# Altium project ORINIUM_UAV.PrjPcb (part 1 of 5)
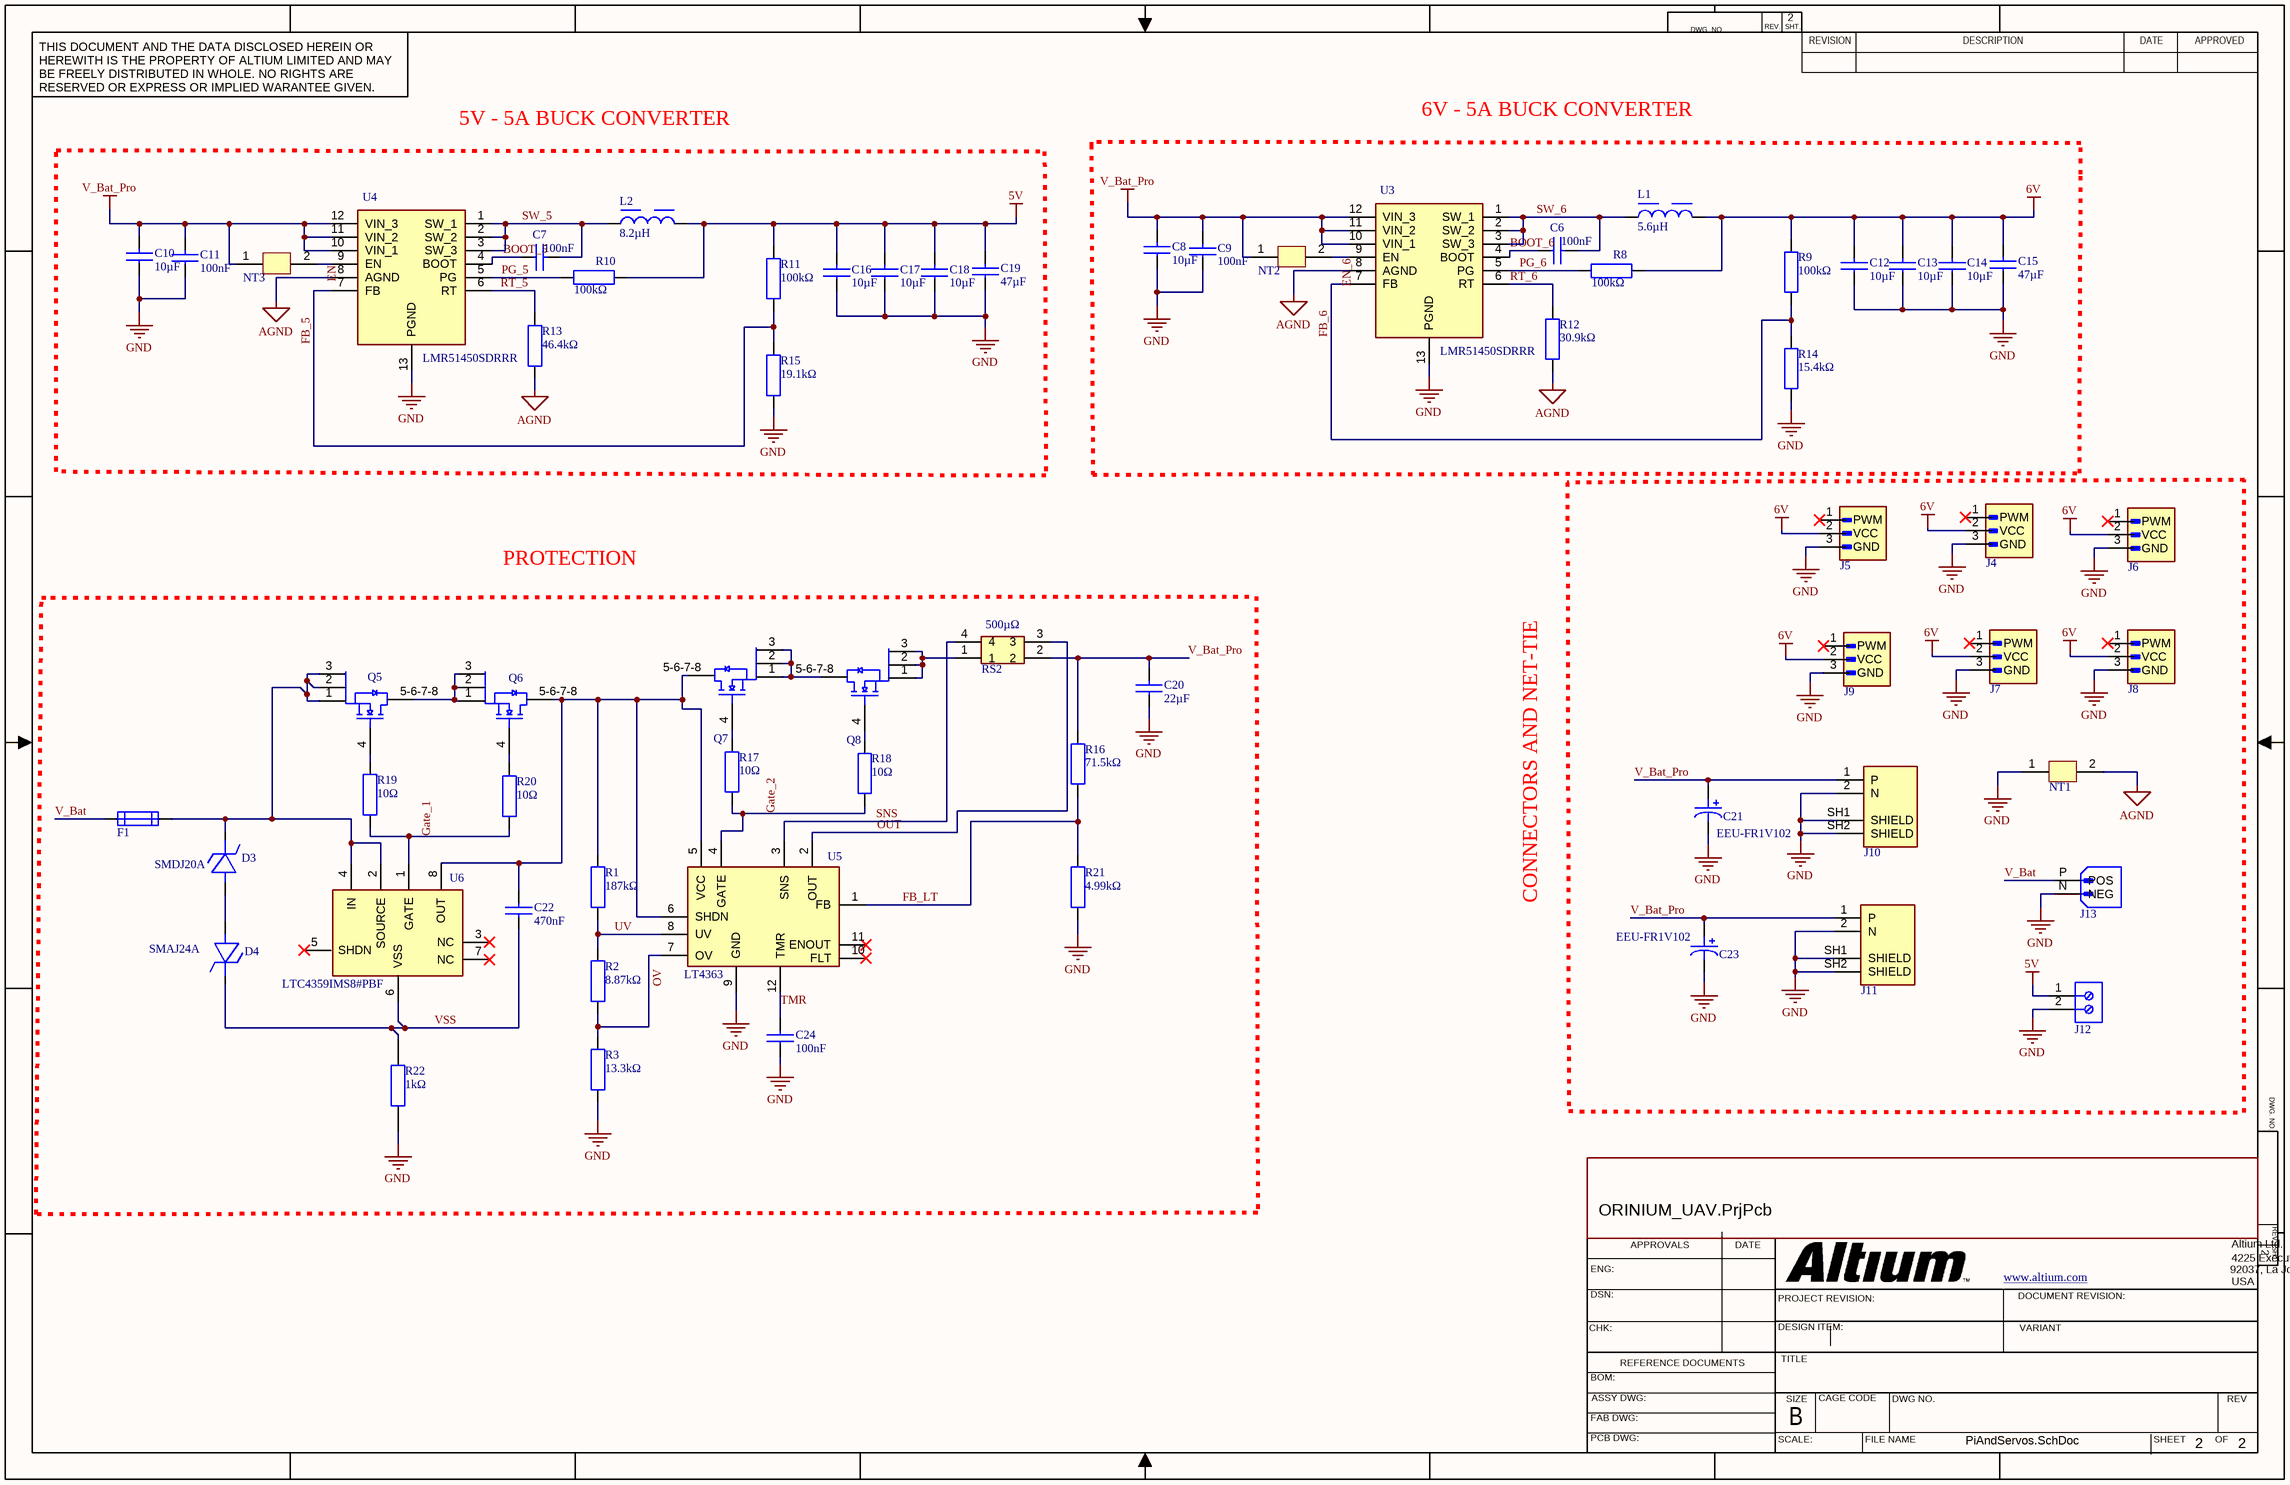
[diagram p0: PiAndServos.SchDoc]
1 sheet, 64 parts. Net scope: global (net labels, ports and power ports of the same name join across sheets).
Board file: UAV.PcbDoc

## Sheet PiAndServos.SchDoc
size 431 x 279 mm; Organization: ORGANIZATION; Address1: ADDRESS 1; Address2: ADDRESS 2; Address3: ADDRESS 3; Address4: ADDRESS 4; Revision: -; SheetNumber: 2; SheetTotal: 2; ENG_APP_DATE: --/--/--; DSN_APP_DATE: --/--/--; CHK_APP_DATE: --/--/--

### Parts
C6  value 100nF  [CAP 0402]  (hidden comment: GRM155R71C104KA88D)
C7  value 100nF  [CAP 0402]  (hidden comment: GRM155R71C104KA88D)
C8  value 10µF  [CAP 1210]  (hidden comment: C3225X7R1H106M250AC)
C9  value 100nF  [CAP 0603]  (hidden comment: CC0603KRX7R9BB104)
C10  value 10µF  [CAP 1210]  (hidden comment: C3225X7R1H106M250AC)
C11  value 100nF  [CAP 0603]  (hidden comment: CC0603KRX7R9BB104)
C12  value 10µF  [CAP 1210]  (hidden comment: C3225X7R1H106M250AC)
C13  value 10µF  [CAP 1210]  (hidden comment: C3225X7R1H106M250AC)
C14  value 10µF  [CAP 1210]  (hidden comment: C3225X7R1H106M250AC)
C15  value 47µF  [CAP 1210]  (hidden comment: GRM32ER61C476KE15L)
C16  value 10µF  [CAP 1210]  (hidden comment: C3225X7R1H106M250AC)
C17  value 10µF  [CAP 1210]  (hidden comment: C3225X7R1H106M250AC)
C18  value 10µF  [CAP 1210]  (hidden comment: C3225X7R1H106M250AC)
C19  value 47µF  [CAP 1210]  (hidden comment: GRM32ER61C476KE15L)
C20  value 22µF  [CAP 2220]  (hidden comment: C5750X7R1H226M250KB)
C21  EEU-FR1V102  [CAP ALUM THT]
C22  value 470nF  [CAP 0603]  (hidden comment: W3F15C4738AT1F)
C23  EEU-FR1V102  [CAP ALUM THT]
C24  value 100nF  [CAP 0402]  (hidden comment: GRM155R71C104KA88D)
D3  SMDJ20A  [SMC (DO-214AB)]
D4  SMAJ24A  [SMA (DO-214AC)]
F1  SF-3812F6000T-2  [SF-3812F6000T-2]  (value not drawn)
J4  61300311121  [1X3 MALE HEADER]  (value not drawn)
J5  61300311121  [1X3 MALE HEADER]  (value not drawn)
J6  61300311121  [1X3 MALE HEADER]  (value not drawn)
J7  61300311121  [1X3 MALE HEADER]  (value not drawn)
J8  61300311121  [1X3 MALE HEADER]  (value not drawn)
J9  61300311121  [1X3 MALE HEADER]  (value not drawn)
J10  XT60PW-M  [XT60PW-M]  (value not drawn)
J11  XT60PW-M  [XT60PW-M]  (value not drawn)
J12  1725656  [1725656]  (value not drawn)
J13  XT90-S  [XT90]  (value not drawn)
L1  value 5.6µH  [XAL6060-822MEB]  (hidden comment: XAL6060-562MEB)
L2  value 8.2µH  [XAL6060-822MEB]  (hidden comment: XAL6060-822MEB)
NT1  Net-Tie  [Net-Tie]  (value not drawn)  (net tie, no BOM)
NT2  Net-Tie  [Net-Tie]  (value not drawn)  (net tie, no BOM)
NT3  Net-Tie  [Net-Tie]  (value not drawn)  (net tie, no BOM)
Q5  BSC010N04LSI  [SON 5X6]  (value not drawn)
Q6  BSC010N04LSI  [SON 5X6]  (value not drawn)
Q7  BSC010N04LSI  [SON 5X6]  (value not drawn)
Q8  BSC010N04LSI  [SON 5X6]  (value not drawn)
R1  value 187kΩ  [RES 1206]  (hidden comment: RC0805FR-07187KL)
R2  value 8.87kΩ  [RES 1206]  (hidden comment: RC0805FR-078K87L)
R3  value 13.3kΩ  [RES 1206]  (hidden comment: RC0805FR-0713K3L)
R8  value 100kΩ  [RES 0603]  (hidden comment: CRCW0603100KFKEA)
R9  value 100kΩ  [RES 0402]  (hidden comment: CRCW0402100KFKED)
R10  value 100kΩ  [RES 0603]  (hidden comment: CRCW0603100KFKEA)
R11  value 100kΩ  [RES 0402]  (hidden comment: CRCW0402100KFKED)
R12  value 30.9kΩ  [RES 0402]  (hidden comment: CRCW040230K9FKED)
R13  value 46.4kΩ  [RES 0603]  (hidden comment: CRCW060346K4FKEA)
R14  value 15.4kΩ  [RES 0402]  (hidden comment: AC0402FR-0715K4L)
R15  value 19.1kΩ  [RES 0402]  (hidden comment: CRCW040219K1FKED)
R16  value 71.5kΩ  [RES 0603]  (hidden comment: RC0603FR-0771K5L)
R17  value 10Ω  [SR0805FR-7W10RL]  (hidden comment: SR0805FR-7W10RL)
R18  value 10Ω  [SR0805FR-7W10RL]  (hidden comment: SR0805FR-7W10RL)
R19  value 10Ω  [SR0805FR-7W10RL]  (hidden comment: SR0805FR-7W10RL)
R20  value 10Ω  [SR0805FR-7W10RL]  (hidden comment: SR0805FR-7W10RL)
R21  value 4.99kΩ  [RES 0402]  (hidden comment: ERJ-2RKF4991X)
R22  value 1kΩ  [RES 1206]  (hidden comment: SR1206FR-071KL)
RS2  value 500µΩ  [SR_4026]  (hidden comment: WSLP4026L5000FEA)
U3  LMR51450SDRRR  [WSON -12]
U4  LMR51450SDRRR  [WSON -12]
U5  LT4363  [MSOP-12]
U6  LTC4359IMS8#PBF  [MSOP-8]

### Blocks framed on the sheet
5V - 5A BUCK CONVERTER: C7 C10 C11 C16-C19 L2 NT3 R10 R11 R13 R15 U4

### Nets
5V: C16.2 C17.2 C18.2 C19.2 J12.1(VCC) L2.2 R10.2 R11.2
6V: C12.2 C13.2 C14.2 C15.2 J4.2(VCC) J5.2(VCC) J6.2(VCC) J7.2(VCC) J8.2(VCC) J9.2(VCC) L1.2 R8.2 R9.2
AGND: NT1.2 R12.1 R13.1 U3.8(AGND) U4.8(AGND)
GND: C8.1 C9.1 C10.1 C11.1 C12.1 C13.1 C14.1 C15.1 C16.1 C17.1 C18.1 C19.1 C20.1 C21.2 C23.2 C24.1 J4.3(GND) J5.3(GND) J6.3(GND) J7.3(GND) J8.3(GND) J9.3(GND) J10.2(N) J10.SH1(SHIELD) J10.SH2(SHIELD) J11.2(N) J11.SH1(SHIELD) J11.SH2(SHIELD) J12.2(GND) J13.N(NEG) NT1.1 R3.1 R14.1 R15.1 R21.1 R22.1 U3.13(PGND) U4.13(PGND) U5.9(GND)
V_Bat_Pro: C8.2 C9.2 C10.2 C11.2 C20.2 C21.1 C23.1 J10.1(P) J11.1(P) NT2.1 NT3.1 R16.2 RS2.2 U3.10(VIN_1) U3.11(VIN_2) U3.12(VIN_3) U4.10(VIN_1) U4.11(VIN_2) U4.12(VIN_3)
BOOT_5: C7.1 U4.4(BOOT)
BOOT_6: C6.1 U3.4(BOOT)
EN: NT3.2 U4.9(EN)
EN_6: NT2.2 U3.9(EN)
FB_5: R11.1 R15.2 U4.7(FB)
FB_6: R9.1 R14.2 U3.7(FB)
FB_LT: R16.1 R21.2 U5.1(FB)
Gate_1: R19.1 R20.1 U6.1(GATE)
Gate_2: R17.1 R18.1 U5.4(GATE)
OUT: RS2.3 U5.2(OUT)
OV: R2.1 R3.2 U5.7(OV)
PG_5: R10.1 U4.5(PG)
PG_6: R8.1 U3.5(PG)
RT_5: R13.2 U4.6(RT)
RT_6: R12.2 U3.6(RT)
SNS: RS2.4 U5.3(SNS)
SW_5: C7.2 L2.1 U4.1(SW_1) U4.2(SW_2) U4.3(SW_3)
SW_6: C6.2 L1.1 U3.1(SW_1) U3.2(SW_2) U3.3(SW_3)
TMR: C24.2 U5.12(TMR)
UV: R1.2 R2.2 U5.8(UV)
V_Bat: F1.1 J13.P(POS)
VSS: C22.1 D4.1 R22.2 U6.6(VSS)
NetC22_2: C22.2 Q6.5-6-7-8(D) Q7.5-6-7-8(D) R1.1 U5.5(VCC) U5.6(SHDN) U6.8(OUT)
NetD3_1: D3.1 F1.2 Q5.1(S) Q5.2(S) Q5.3(S) U6.2(SOURCE) U6.4(IN)
NetD3_2: D3.2 D4.2
NetQ5_4: Q5.4(G) R19.2
NetQ5_5-6-7-8: Q5.5-6-7-8(D) Q6.1(S) Q6.2(S) Q6.3(S)
NetQ6_4: Q6.4(G) R20.2
NetQ7_1: Q7.1(S) Q7.2(S) Q7.3(S) Q8.5-6-7-8(D)
NetQ7_4: Q7.4(G) R17.2
NetQ8_1: Q8.1(S) Q8.2(S) Q8.3(S) RS2.1
NetQ8_4: Q8.4(G) R18.2

Not connected (* = marked no-connect by the designer): J4 1(PWM)*; J5 1(PWM)*; J6 1(PWM)*; J7 1(PWM)*; J8 1(PWM)*; J9 1(PWM)*; U5 10(FLT)* 11(ENOUT)*; U6 3(NC)* 5(SHDN)* 7(NC)*

### Notes on the sheet
- 6V - 5A BUCK CONVERTER
- PROTECTION
- CONNECTORS AND NET-TIE
- DWG. NO.
- REV.
- SHT.
- THIS DOCUMENT AND THE DATA DISCLOSED HEREIN OR HEREWITH IS THE PROPERTY OF ALTIUM LIMITED AND MAY BE FREELY DISTRIBUTED IN WHOLE. NO RIGHTS ARE RESERVED OR EXPRESS OR IMPLIED WARANTEE GIVEN.
- REVISION
- DESCRIPTION
- DATE
- APPROVED
- ENG:
- DSN:
- APPROVALS
- PROJECT REVISION:
- www.altium.com <http://www.altium.com>
- DOCUMENT REVISION:
- 92037, La Jolla
- USA
- Altium Ltd.
- 4225 Executive Square
- CHK:
- REFERENCE DOCUMENTS
- DESIGN ITEM:
- TITLE
- VARIANT
- BOM:
- FAB DWG:
- PCB DWG:
- ASSY DWG:
- SCALE:
- SIZE
- B
- CAGE CODE
- FILE NAME
- DWG NO.
- SHEET
- OF
- REV